# Altium schematic sheet Power.SchDoc
size A4; SheetNumber: 6; SheetTotal: 6
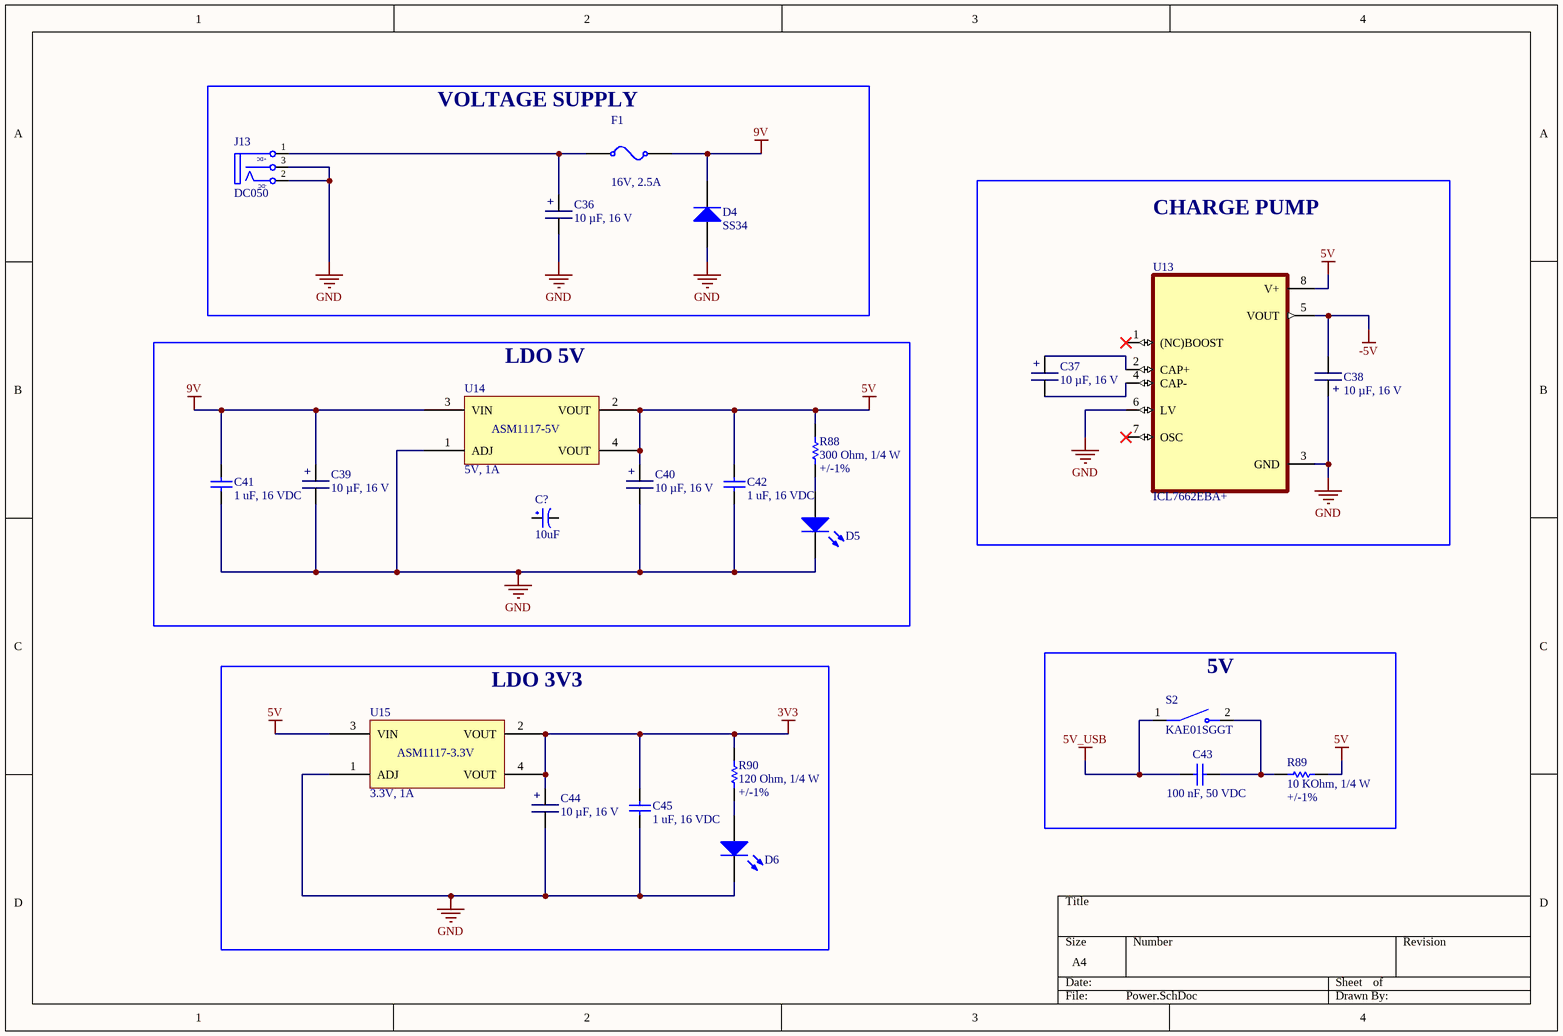
[diagram p0: Power.SchDoc]

## Parts
C36  10 µF, 16 V  [TANTALUM SMD A]
C37  10 µF, 16 V  [TANTALUM SMD A]
C38  10 µF, 16 V  [TANTALUM SMD A]
C39  10 µF, 16 V  [TANTALUM SMD A]
C40  10 µF, 16 V  [TANTALUM SMD A]
C41  1 uF, 16 VDC  [CAP_0603]
C42  1 uF, 16 VDC  [CAP_0603]
C43  100 nF, 50 VDC  [CAP_0603]
C44  10 µF, 16 V  [TANTALUM SMD A]
C45  1 uF, 16 VDC  [CAP_0603]
C?  10uF  [tu tantalum smd3216]
D4  SS34  [DIODE SMA]
D5  LED SMD  [LED_0805_Blue]  (value not drawn)
D6  LED SMD  [LED_0805_Blue]  (value not drawn)
F1  16V, 2.5A  [Fuse_SMD_1812]
J13  DC050  [DC050]
R88  300 Ohm, 1/4 W  Resistance Tolerance: +/-1%  [resistor_0603]
R89  10 KOhm, 1/4 W  Resistance Tolerance: +/-1%  [resistor_0603]
R90  120 Ohm, 1/4 W  Resistance Tolerance: +/-1%  [resistor_0603]
S2  KAE01SGGT  [SW_KAE01SGGT]
U13  ICL7662EBA+  [SOIC127P600X175-8N]
U14  5V, 1A  [AMS1117-5V SOT223]
U15  3.3V, 1A  [AMS1117-3.3V SOT223]

## Blocks framed on the sheet
VOLTAGE SUPPLY: C36 D4 F1 J13
CHARGE PUMP: C37 C38 U13
LDO 5V: C39-C42 C? D5 R88 U14
LDO 3V3: C44 C45 D6 R90 U15
5V: C43 R89 S2

## Nets
3V3: C44.2 C45.2 R90.2 U15.2(VOUT) U15.4(VOUT)
5V: C40.2 C42.2 R88.2 R89.2 U13.8(V+) U14.2(VOUT) U14.4(VOUT) U15.3(VIN)
5V_USB: C43.1 S2.1
9V: C39.2 C41.2 D4.2(K) F1.1 U14.3(VIN)
-5V: C38.1 U13.5(VOUT)
GND: C36.1 C38.2 C39.1 C40.1 C41.1 C42.1 C44.1 C45.1 D4.1(A) D5.2(K) D6.2(K) J13.2(TN) J13.3(S) U13.3(GND) U13.6(LV) U14.1(ADJ) U15.1(ADJ)
NetC36_2: C36.2 F1.0 J13.1(T)
NetC37_1: C37.1 U13.4(CAP-)
NetC37_2: C37.2 U13.2(CAP+)
NetC43_2: C43.2 R89.1 S2.2
NetD5_1: D5.1(A) R88.1
NetD6_1: D6.1(A) R90.1

Not connected (* = marked no-connect by the designer): C? 1 2; U13 1((NC)BOOST)* 7(OSC)*

## Notes on the sheet
- (in symbol 01120610610) +
- (in symbol AMS1117-3.3V) ASM1117-3.3V
- (in symbol AMS1117-5V) ASM1117-5V
- (in symbol DC050) +DC; -DC

## Library data of the parts
C36-C40 C44 = 01120610610: CAP TANT 10uF 10% 16V 1206; Manufacture  Name: KYOCERA AVX; Manufacture  SN: TPSA106K016R1000; Capacitance Tolerance: +/-10%; ComponentLink1Description: Datasheet link; ComponentLink1URL: https://datasheets.kyocera-avx.com/TAJ.pdf; ComponentLink2Description: Supplier 1 URL; ComponentLink2URL: https://www.mouser.vn/ProductDetail/KYOCERA-AVX/TPSA106K016R1000?qs=GLv2FRWg8zkKT7IxHlCjvQ%3D%3D; Size: 1206; Mounting Technology: SMT; Capacitance: 10uF; ComponentLink3Description: Supplier 2 URL; ComponentLink3URL: https://www.digikey.com/en/products/detail/kyocera-avx/TPSA106K016R1000/7536120; ComponentLink4Description: Supplier 3 URL; ComponentLink4URL: https://www.thegioiic.com/tu-tantalum-10uf-16v-1206-taja106k016rnj; Supplier 1 Name: Mouser; Supplier 1 SN: 581-TPSA106K016R1000; Supplier 1 URL: https://www.mouser.vn/ProductDetail/KYOCERA-AVX/TPSA106K016R1000?qs=GLv2FRWg8zkKT7IxHlCjvQ%3D%3D; Supplier 2 Name: Digi-Key; Supplier 2 SN: 478-10757-1-ND; Supplier 2 URL: https://www.digikey.com/en/products/detail/kyocera-avx/TPSA106K016R1000/7536120; Supplier 3 Name: thegioiic; Supplier 3 SN: N/A; Supplier 3 URL: https://www.thegioiic.com/tu-tantalum-10uf-16v-1206-taja106k016rnj; Value: 10 µF, 16 V; Rated Voltage: 16 V
C41 C42 C45 = 0106031051016: CAP, size 0603, 1 uF, 16 VDC; Manufacture Name: Samsung Electro-Mechanics; Manufacture SN: CL10B105KO8NNWC; Capacitance: 1 uF; Tolerance: +/-10%; Voltage Rating DC: 16 VDC; ComponentLink2Description: Datasheet; ComponentLink2URL: https://www.mouser.vn/datasheet/2/585/Samsung_MLCC_1837944-1929650.pdf; Operating Temperature: -55 to +125degC; Packaging: Tape and Reel; Mounting Technology: SMT; Size: 0603; Supplier 1 Name: Mouser; Supplier 1 SN: 187-CL10B105KO8NNWC; Supplier 1 URL: https://www.mouser.vn/ProductDetail/Samsung-Electro-Mechanics/CL10B105KO8NNWC?qs=81r%252BiQLm7BT%252BXtc72qn1ug%3D%3D&utm_source=mouser-refine-download&utm_medium=file&utm_campaign=CL10B105KO8NNWC&utm_content=Samsung-Electro-Mechanics; Supplier 2 Name: Digi-Key; Supplier 2 SN: 1276-CL10B105KO8NNWCTR-ND; Supplier 2 URL: https://www.digikey.com/en/products/detail/samsung-electro-mechanics/cl10b105ko8nnwc/16572783; Supplier 3 Name: thegioiic; Supplier 3 SN: N/A; Supplier 3 URL: https://www.thegioiic.com/tu-gom-0603-1uf-16v; Value: 1 uF, 16 VDC
C43 = 0106031041050: CAP, size 0603, 100 nF, 50 VDC; Manufacture Name: TDK; Manufacture SN: CGA3E3X8R1H104K080AE; Capacitance: 100 nF; Tolerance: +/-10%; Voltage Rating DC: 50 VDC; ComponentLink2Description: Datasheet; ComponentLink2URL: https://product.tdk.com/system/files/dam/doc/product/capacitor/ceramic/mlcc/catalog/mlcc_automotive_soft_en.pdf?ref_disty=mouser; Operating Temperature: -55 to +125degC; Packaging: Tape and Reel; Mounting Technology: SMT; Size: 0603; Supplier 1 Name: Mouser; Supplier 1 SN: 810-CGA3E3X8R1H104KA; Supplier 1 URL: https://www.mouser.com/ProductDetail/TDK/CGA3E3X8R1H104K080AE?qs=nQSIdc08i%252Bd8g3IRRgU2bw%3D%3D&utm_source=mouser-refine-download&utm_medium=file&utm_campaign=CGA3E3X8R1H104K080AE&utm_content=TDK; Supplier 2 Name: Digi-Key; Supplier 2 SN: 445-173697-2-ND; Supplier 2 URL: https://www.digikey.com/en/products/detail/tdk-corporation/cga3e3x8r1h104k080ae/5809262; Supplier 3 Name: thegioiic; Supplier 3 SN: N/A; Supplier 3 URL: N/A; Value: 100 nF, 50 VDC
C? = Tu tantalum 10uF 16V SMD3216: Dán; Don_Vi: Con; So_Chan: 2; Ten_Linh_Kien: Tụ tantalum 106C-10uF 16V SMD3216; Ma_Hang: MH001954; Chung_Loai: Dán; Kieu_Chan: *
D4 = Diode SS34 ( 1N5822 ): Dán; Don_Vi: Con; Ma_Hang: MH002104; Ten_Linh_Kien: Diode SS34 3A 40V SMA ( 1N5822 SS34A); Kieu_Chan: *; Chung_Loai: Dán
D5 D6 = LED SMD: LED
F1 = 061812250016: Resettable Fuse, Size 1812, 16V, 2.5A; Manufacturer: Bourns; Threshold Current: 100A; Trip Current: 5A; Threshold Voltage: 16V; Hold Current: 2.5A; Size: 1812; Mounting Technology: SMT/SMD; ComponentLink1Description: Datasheet link; ComponentLink1URL: https://www.bourns.com/docs/Product-Datasheets/mfnsmf.pdf; ComponentLink2Description: Supplier 1 URL; ComponentLink2URL: https://www.mouser.vn/ProductDetail/Bourns/MF-MSMF250-16X-2?qs=9fn1gpisni78zr7pGyDhCQ%3D%3D; ComponentLink3Description: Supplier 2 URL; ComponentLink3URL: https://www.digikey.com/en/products/detail/bourns-inc/MF-MSMF250-16X-2/2563289; ComponentLink4Description: Supplier 3 URL; ComponentLink4URL: https://www.thegioiic.com/mf-msmf250-16-cau-chi-tu-phuc-hoi-1812-16v-2-5a; Supplier 1 Name: Mouser; Supplier 1 SN: 652-MF-MSMF250/16X-2; Supplier 1 URL: https://www.mouser.vn/ProductDetail/Bourns/MF-MSMF250-16X-2?qs=9fn1gpisni78zr7pGyDhCQ%3D%3D; Supplier 2 Name: Digi-Key; Supplier 2 SN: MF-MSMF250/16X-2TR-ND; Supplier 2 URL: https://www.mouser.vn/ProductDetail/Bourns/MF-MSMF250-16X-2?qs=9fn1gpisni78zr7pGyDhCQ%3D%3D; Supplier 3 Name: thegioiic; Supplier 3 SN: MF-MSMF250/16; Supplier 3 URL: https://www.thegioiic.com/mf-msmf250-16-cau-chi-tu-phuc-hoi-1812-16v-2-5a; Value: 16V, 2.5A
J13 = DC050: Surface Mount，Right Angle DC Power Receptacle 2mm 6.4mm 4A 16V SMD AC/DC Power Connectors ROHS; Manufacturer: OEM; Manufacturer Part Number: SHOU HAN; Rated Current: 2.5A; ComponentLink1Description: Datasheet link; ComponentLink1URL: https://datasheet.lcsc.com/lcsc/1912111437_SHOU-HAN-DC050-T_C431534.pdf?_gl=1*18nk6nd*_ga*MTI1Mzk4MDEzNi4xNzAxOTIwNDk2*_ga_98M84MKSZH*MTcxMTA5NjQ0Ny4xNjYuMS4xNzExMTAwNDQzLjI2LjAuMA..; Mount: SMD/SMT; Number of Pins: 4; Operating Temperature Max: N/A; Operating Temperature Min: N/A; Packaging: N/A; Supplier 1 URL: N/A; Supplier 2 URL: N/A; Supplier 3 URL: https://www.thegioiic.com/dc050-dau-noi-nguon-dc-cai-5521-dan-smd-kim-2-1mm; Value: DC050; LCSC Part #: C431534; Supplier 1: Mouser; Supplier 1 Part Number: N/A; Supplier 2: Digi-Key; Supplier 2 Part Number: N/A; Supplier 3: thegioiic; Supplier 3 Part Number: DC050; Voltage Rating DC: 16V
R88 = 0006033011: RES, size 0603, 300 Ohm, 1/4 W; Manufacture  Name: OEM; Rated Power: 1/4 W; Resistance: 300 Ohm; Size: 0603; Mounting Technology: SMT; Supplier 1 Name: Mouser; Supplier 1 SN: 755-SDR03EZPF3000; Supplier 1 URL: https://www.mouser.vn/ProductDetail/ROHM-Semiconductor/SDR03EZPF3000?qs=MyNHzdoqoQKYsGXohuNk8Q%3D%3D; Supplier 2 Name: Digi-Key; Supplier 2 SN: 13-RC0603FR-10300RLTR-ND; Supplier 3 Name: thegioiic; Supplier 3 SN: N/A; Supplier 3 URL: N/A; Manufacture  SN: OEM; Value: 300 Ohm, 1/4 W; ComponentLink1Description: Datasheet link; ComponentLink1URL: N/A; ComponentLink2Description: Supplier 1 URL; ComponentLink2URL: N/A; ComponentLink3Description: Supplier 2 URL; ComponentLink3URL: https://www.digikey.com/en/products/detail/yageo/RC0603FR-10300RL/14008461; ComponentLink4Description: Supplier 3 URL; ComponentLink4URL: N/A; Supplier 2 URL: https://www.digikey.com/en/products/detail/yageo/RC0603FR-10300RL/14008461
R89 = 0006031031: RES, size 0603, 10 KOhm, 1/4 W; Manufacture  Name: OEM; Resistance: 10 KOhm; Rated Power: 1/4 W; Size: 0603; Mounting Technology: SMT; Supplier 1 Name: Mouser; Supplier 1 SN: 755-ESR03EZPF1002; Supplier 2 Name: Digi-Key; Supplier 2 SN: RHM10KADTR-ND RHM10KADCT-ND RHM10KADDKR-ND; Supplier 1 URL: https://www.mouser.vn/ProductDetail/ROHM-Semiconductor/ESR03EZPF1002?qs=sGAEpiMZZMvdGkrng054t67Efho1F8r6CDeAsqwFse8%3D; Supplier 3 Name: thegioiic; Supplier 3 SN: N/A; Supplier 3 URL: N/A; Manufacture  SN: OEM; Value: 10 KOhm, 1/4 W; ComponentLink1Description: Datasheet link; ComponentLink1URL: https://fscdn.rohm.com/en/products/databook/datasheet/passive/resistor/chip_resistor/esr-e.pdf; ComponentLink2Description: Supplier 1 URL; ComponentLink2URL: N/A; ComponentLink3Description: Supplier 2 URL; ComponentLink3URL: https://www.digikey.com/en/products/detail/rohm-semiconductor/ESR03EZPF1002/1983429; ComponentLink4Description: Supplier 3 URL; ComponentLink4URL: N/A; Supplier 2 URL: https://www.digikey.com/en/products/detail/rohm-semiconductor/ESR03EZPF1002/1983429
R90 = 0006031211: RES, size 0603, 120 Ohm, 1/4 W; Manufacture  Name: OEM; Resistance: 120 Ohm; Rated Power: 1/4 W; Size: 0603; Mounting Technology: SMT; Supplier 1 Name: Mouser; Supplier 1 SN: 603-SR0603FR-7T120RL; Supplier 2 Name: Digi-Key; Supplier 2 SN: YAG5825TR-ND YAG5825CT-ND YAG5825DKR-ND; Supplier 1 URL: https://www.mouser.vn/ProductDetail/YAGEO/SR0603FR-7T120RL?qs=sGAEpiMZZMvdGkrng054tz1y1XEHv7sNpzSbq0ZWZmOggb8s%252BZMxlg%3D%3D; Supplier 3 Name: thegioiic; Supplier 3 SN: N/A; Supplier 3 URL: N/A; Manufacture  SN: OEM; Value: 120 Ohm, 1/4 W; ComponentLink1Description: Datasheet link; ComponentLink1URL: https://www.yageo.com/upload/media/product/productsearch/datasheet/rchip/PYu-SR_20105_RoHS_L_10.pdf; ComponentLink2Description: Supplier 1 URL; ComponentLink2URL: N/A; ComponentLink3Description: Supplier 2 URL; ComponentLink3URL: https://www.digikey.com/en/products/detail/yageo/SR0603FR-7T120RL/9373099; ComponentLink4Description: Supplier 3 URL; ComponentLink4URL: N/A; Supplier 2 URL: https://www.digikey.com/en/products/detail/yageo/SR0603FR-7T120RL/9373099
S2 = KAE01SGGT: Dip Switch SPST 1 Position Surface Mount Slide (Standard) Actuator 25mA 24VDC; MF: E-Switch; Check_prices: https://www.snapeda.com/parts/KAE01SGGT/E-Switch/view-part/?ref=eda; Value: *; Availability: In Stock; MP: KAE01SGGT; Price: None; Package: None; SnapEDA_Link: https://www.snapeda.com/parts/KAE01SGGT/E-Switch/view-part/?ref=snap; Purchase-URL: https://pricing.snapeda.com/search/part/KAE01SGGT/?ref=eda
U13 = ICL7662EBA+: CMOS, Voltage Converters; MF: Analog Devices; SnapEDA_Link: https://www.snapeda.com/parts/ICL7662EBA+/Analog+Devices/view-part/?ref=snap; Package: SOIC-8 Maxim; Value: *; MP: ICL7662EBA+; Check_prices: https://www.snapeda.com/parts/ICL7662EBA+/Analog+Devices/view-part/?ref=eda
U14 = AMS1117-5V: AMS1117-5V, OUT 5V 1A.; Manufacturer: AMS; Pad Count: 4; Voltage Input Maximum: 15V; Manufacturer Part Number: N/A; Current Input Maximum: N/A; Current Output Maximum: 1A; Supplier 1 Name: Mouser; Supplier 2 Name: Digi-Key; Supplier 3 Name: thegioiic; Voltage Output: 5V; Mounting Technology: SMD; ComponentLink1Description: Datasheet link; ComponentLink1URL: N/A; ComponentLink2Description: Supplier 1 URL; ComponentLink2URL: N/A; ComponentLink3Description: Supplier 2 URL; ComponentLink3URL: N/A; ComponentLink4Description: Supplier 3 URL; ComponentLink4URL: N/A; Supplier 1 SN: N/A; Supplier 1 URL: N/A; Supplier 2 SN: N/A; Supplier 2 URL: N/A; Supplier 3 SN: N/A; Supplier 3 URL: https://www.thegioiic.com/ams1117-5-0v-ic-on-ap-5v-1a-sot-223; Value: 5V, 1A
U15 = AMS1117-3.3V: AMS1117-3.3V, OUT 3.3V 1A.; Manufacturer: AMS; Pad Count: 4; Voltage Input Maximum: 15V; Manufacturer Part Number: N/A; Current Input Maximum: N/A; Current Output Maximum: 1A; Supplier 1 Name: Mouser; Supplier 2 Name: Digi-Key; Supplier 3 Name: thegioiic; Voltage Output: 3.3V; Mounting Technology: SMD; ComponentLink1Description: Datasheet link; ComponentLink1URL: http://www.advanced-monolithic.com/pdf/ds1117.pdf; ComponentLink2Description: Supplier 1 URL; ComponentLink2URL: N/A; ComponentLink3Description: Supplier 2 URL; ComponentLink3URL: N/A; ComponentLink4Description: Supplier 3 URL; ComponentLink4URL: N/A; Supplier 1 SN: N/A; Supplier 1 URL: N/A; Supplier 2 SN: N/A; Supplier 2 URL: N/A; Supplier 3 SN: N/A; Supplier 3 URL: https://www.thegioiic.com/ams1117-3-3v-ic-on-ap-3-3v-1a-sot-223; Value: 3.3V, 1A